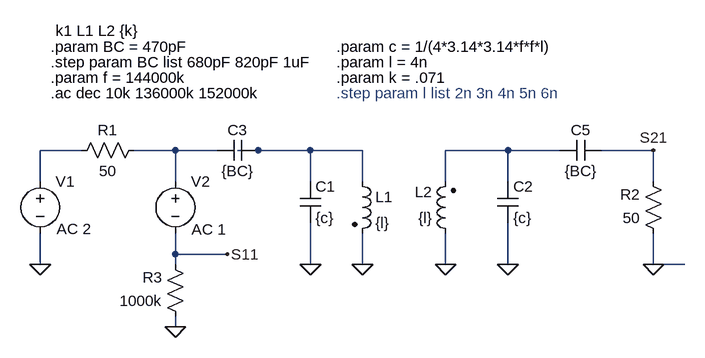
[diagram p0: schematic ece522p1.3.asc]
ece522p1.3.asc, the LTspice schematic file:
Version 4
SHEET 1 1316 680
WIRE -240 112 -304 112
WIRE -96 112 -160 112
WIRE -32 112 -96 112
WIRE 32 112 0 112
WIRE 112 112 32 112
WIRE 192 112 112 112
WIRE 416 112 320 112
WIRE 496 112 416 112
WIRE 640 112 560 112
WIRE -304 160 -304 112
WIRE -96 160 -96 112
WIRE 112 160 112 112
WIRE 192 160 192 112
WIRE 320 160 320 112
WIRE 416 160 416 112
WIRE 640 160 640 112
WIRE -96 272 -96 240
WIRE -16 272 -96 272
WIRE -304 288 -304 240
WIRE -96 288 -96 272
WIRE 112 288 112 224
WIRE 192 288 192 240
WIRE 320 288 320 240
WIRE 416 288 416 224
WIRE 640 288 640 240
WIRE 688 288 640 288
WIRE -96 384 -96 368
WIRE -96 384 -112 384
FLAG -304 288 0
FLAG -96 384 0
FLAG 112 288 0
FLAG 192 288 0
FLAG 416 288 0
FLAG 640 288 0
FLAG 320 288 0
FLAG -16 272 S11
FLAG 640 112 S21
SYMBOL cap 96 160 R0
SYMATTR InstName C1
SYMATTR Value {c}
SYMBOL cap 400 160 R0
SYMATTR InstName C2
SYMATTR Value {c}
SYMBOL cap 32 96 R90
WINDOW 0 0 32 VBottom 2
WINDOW 3 32 32 VTop 2
SYMATTR InstName C3
SYMATTR Value {BC}
SYMBOL cap 560 96 R90
WINDOW 0 0 32 VBottom 2
WINDOW 3 32 32 VTop 2
SYMATTR InstName C5
SYMATTR Value {BC}
SYMBOL res -144 96 R90
WINDOW 0 0 56 VBottom 2
WINDOW 3 32 56 VTop 2
SYMATTR InstName R1
SYMATTR Value 50
SYMBOL res 656 256 R180
WINDOW 0 36 76 Left 2
WINDOW 3 36 40 Left 2
SYMATTR InstName R2
SYMATTR Value 50
SYMBOL res -80 384 R180
WINDOW 0 36 76 Left 2
WINDOW 3 36 40 Left 2
SYMATTR InstName R3
SYMATTR Value 1000k
SYMBOL ind2 176 144 R0
SYMATTR InstName L1
SYMATTR Value {l}
SYMATTR Type ind
SYMBOL ind2 336 256 R180
WINDOW 0 36 80 Left 2
WINDOW 3 36 40 Left 2
SYMATTR InstName L2
SYMATTR Value {l}
SYMATTR Type ind
SYMBOL voltage -304 144 R0
WINDOW 123 25 89 Left 2
WINDOW 39 0 0 Left 0
SYMATTR Value2 AC 2
SYMATTR InstName V1
SYMATTR Value ""
SYMBOL voltage -96 144 R0
WINDOW 123 25 90 Left 2
WINDOW 39 0 0 Left 0
SYMATTR Value2 AC 1
SYMATTR InstName V2
SYMATTR Value ""
TEXT -288 24 Left 2 !.ac dec 10k 136000k 152000k
TEXT -288 0 Left 2 !.param f = 144000k
TEXT -280 -72 Left 2 !k1 L1 L2 {k}
TEXT -288 -48 Left 2 !.param BC = 470pF
TEXT 152 -48 Left 2 !.param c = 1/(4*3.14*3.14*f*f*l)
TEXT 152 -24 Left 2 !.param l = 4n
TEXT 152 0 Left 2 !.param k = .071
TEXT 152 24 Left 2 ;.step param l list 2n 3n 4n 5n 6n
TEXT -288 -24 Left 2 !.step param BC list 680pF 820pF 1uF

The netlist it stands for:
* ece522p1.3.asc
C1 N003 0 {c}
C2 N004 0 {c}
C3 N003 N002 {BC}
C5 S21 N004 {BC}
R1 N002 N001 50
R2 0 S21 50
R3 0 S11 1000k
L1 N003 0 {l}
L2 0 N004 {l}
V1 N001 0 AC 2
V2 N002 S11 AC 1
.ac dec 10k 136000k 152000k
.param f = 144000k
k1 L1 L2 {k}
.param BC = 470pF
.param c = 1/(4*3.14*3.14*f*f*l)
.param l = 4n
.param k = .071
* .step param l list 2n 3n 4n 5n 6n
.step param BC list 680pF 820pF 1uF
.backanno
.end